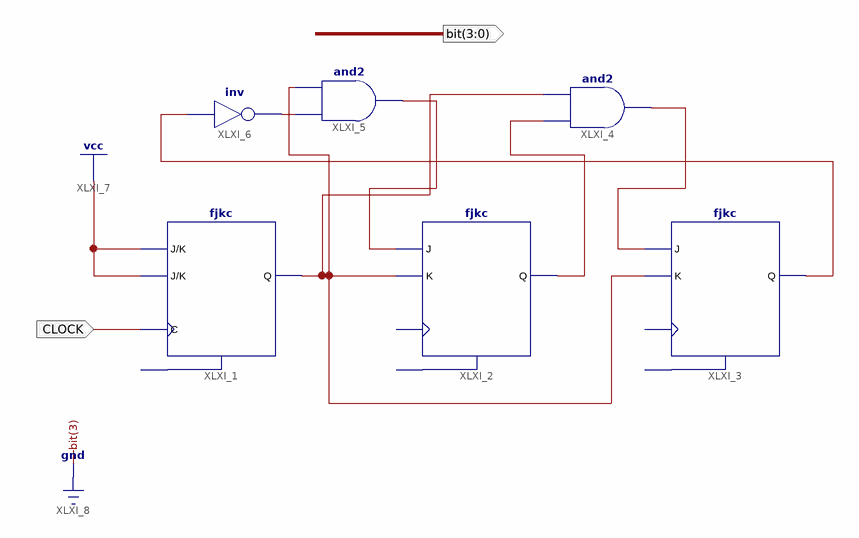
[diagram p0: schematic sheet 1]
// Xilinx ISE schematic counter06.sch (spartan6) as structural Verilog: 6 symbols, 2 ports
module counter06 (
  input  CLOCK,
  output [3:0] \bit 
);

  wire XLXN_1, XLXN_7, XLXN_10;

  fjkc XLXI_1 (.C(CLOCK), .J(1'b1), .K(1'b1), .Q(\bit [0]));  // open: CLR
  fjkc XLXI_2 (.J(XLXN_7), .K(\bit [0]), .Q(\bit [1]));  // open: C, CLR
  fjkc XLXI_3 (.J(XLXN_10), .K(\bit [0]), .Q(\bit [2]));  // open: C, CLR
  and XLXI_4 (XLXN_10, \bit [1], \bit [0]);
  and XLXI_5 (XLXN_7, XLXN_1, \bit [0]);
  not XLXI_6 (XLXN_1, \bit [2]);

  assign \bit [3] = 1'b0;
endmodule
